# Altium schematic sheet EV76C661_Motherboard.SchDoc
size A3; Address1: Address1; Address2: Address2; Address3: Address3; Address4: Address4; DocumentNumber: АБВГ.123456.001 Э3; SheetNumber: 1; Scale: 1:1; DocumentType: Схема электрическая принципиальная; FirstReferrence: АБВГ.123456.001
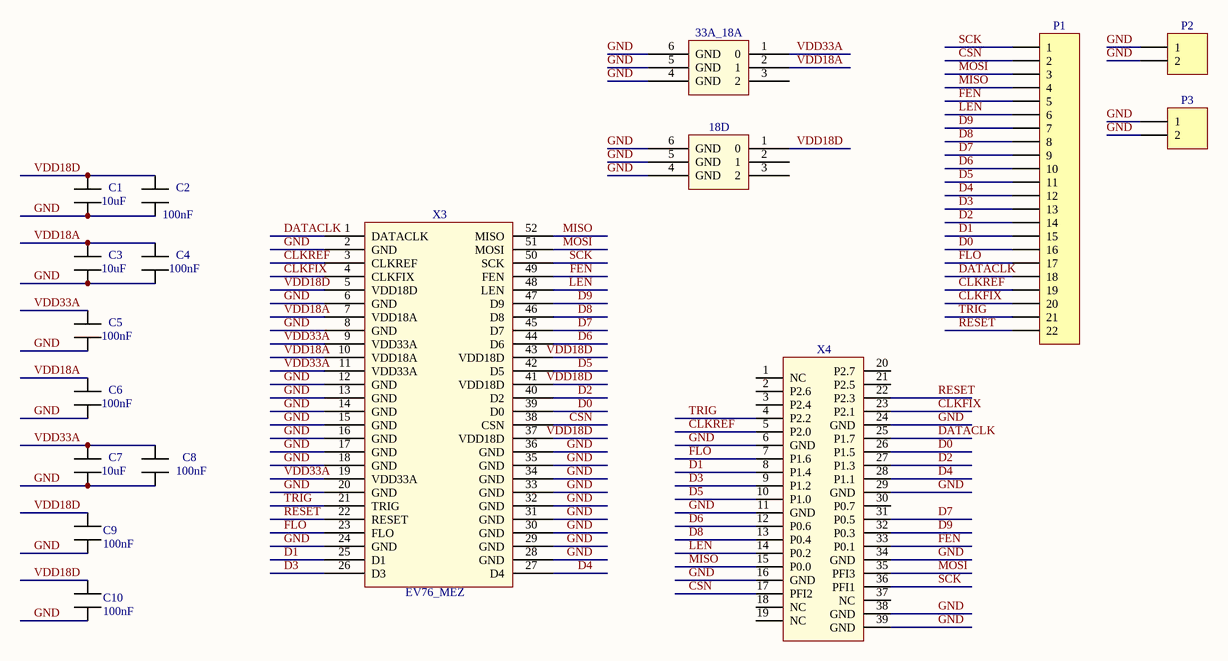
[diagram p0: EV76C661_Motherboard.SchDoc]

## Parts
18D  POWER  [POWER]  (value not drawn)
33A_18A  POWER  [POWER]  (value not drawn)
C1  10uF  [Cap_BIG]
C2  100nF  [CAP_SMALL]
C3  10uF  [Cap_BIG]
C4  100nF  [CAP_SMALL]
C5  100nF  [CAP_SMALL]
C6  100nF  [CAP_SMALL]
C7  10uF  [Cap_BIG]
C8  100nF  [CAP_SMALL]
C9  100nF  [CAP_SMALL]
C10  100nF  [CAP_SMALL]
P1  Header 22  [HDR1X22]  (value not drawn)
P2  Header 2  [HDR1X2]  (value not drawn)
P3  Header 2  [HDR1X2]  (value not drawn)
X3  EV76_MEZ  [EV76C661_MEZONINE]
X4  CHEAP_CON_37_FEMALE  [CHEAP_CONN_FEMALE]  (value not drawn)

## Nets
CLKFIX: P1.20 X3.4(CLKFIX) X4.23(P2.1)
CLKREF: P1.19 X3.3(CLKREF) X4.5(P2.0)
CSN: P1.2 X3.38(CSN) X4.17(PFI2)
D0: P1.16 X3.39(D0) X4.26(P1.5)
D1: P1.15 X3.25(D1) X4.8(P1.4)
D2: P1.14 X3.40(D2) X4.27(P1.3)
D3: P1.13 X3.26(D3) X4.9(P1.2)
D4: P1.12 X3.27(D4) X4.28(P1.1)
D5: P1.11 X3.42(D5) X4.10(P1.0)
D6: P1.10 X3.44(D6) X4.12(P0.6)
D7: P1.9 X3.45(D7) X4.31(P0.5)
D8: P1.8 X3.46(D8) X4.13(P0.4)
D9: P1.7 X3.47(D9) X4.32(P0.3)
DATACLK: P1.18 X3.1(DATACLK) X4.25(P1.7)
FEN: P1.5 X3.49(FEN) X4.33(P0.1)
FLO: P1.17 X3.23(FLO) X4.7(P1.6)
GND: 18D.4(GND) 18D.5(GND) 18D.6(GND) 33A_18A.4(GND) 33A_18A.5(GND) 33A_18A.6(GND) C1.1 C2.2 C3.1 C4.2 C5.1 C6.2 C7.1 C8.2 C9.1 C10.1 P2.1 P2.2 P3.1 P3.2 X3.2(GND) X3.6(GND) X3.8(GND) X3.12(GND) X3.13(GND) X3.14(GND) X3.15(GND) X3.16(GND) X3.17(GND) X3.18(GND) X3.20(GND) X3.24(GND) X3.28(GND) X3.29(GND) X3.30(GND) X3.31(GND) X3.32(GND) X3.33(GND) X3.34(GND) X3.35(GND) X3.36(GND) X4.6(GND) X4.11(GND) X4.16(GND) X4.24(GND) X4.29(GND) X4.34(GND) X4.38(GND) X4.39(GND)
LEN: P1.6 X3.48(LEN) X4.14(P0.2)
MISO: P1.4 X3.52(MISO) X4.15(P0.0)
MOSI: P1.3 X3.51(MOSI) X4.35(PFI3)
RESET: P1.22 X3.22(RESET) X4.22(P2.3)
SCK: P1.1 X3.50(SCK) X4.36(PFI1)
TRIG: P1.21 X3.21(TRIG) X4.4(P2.2)
VDD18A: 33A_18A.2(1) C3.2 C4.1 C6.1 X3.7(VDD18A) X3.10(VDD18A)
VDD18D: 18D.1(0) C1.2 C2.1 C9.2 C10.2 X3.5(VDD18D) X3.37(VDD18D) X3.41(VDD18D) X3.43(VDD18D)
VDD33A: 33A_18A.1(0) C5.2 C7.2 C8.1 X3.9(VDD33A) X3.11(VDD33A) X3.19(VDD33A)

Not connected (* = marked no-connect by the designer): 18D 2(1) 3(2); 33A_18A 3(2); X4 1(NC) 2(P2.6) 3(P2.4) 18(NC) 19(NC) 20(P2.7) 21(P2.5) 30(P0.7) 37(NC)

## Notes on the sheet
- Title
- Size:
- Date:
- A3
- Number:
- Time:
- Revision:
- Sheet
- of
- File:

## Library data of the parts
C1 C3 C7 = CAP_BIG
C2 C4-C6 C8-C10 = CAP_SMALL
P1 = Header 22: Header, 22-Pin; LatestRevisionDate: 17-Jul-2002; LatestRevisionNote: Re-released for DXP Platform.; Publisher: Altium Limited
P2 P3 = Header 2: Header, 2-Pin; LatestRevisionDate: 17-Jul-2002; LatestRevisionNote: Re-released for DXP Platform.; Publisher: Altium Limited
X3 = EV76C661_MEZ